# EAGLE design gps (EAGLE 5.12)
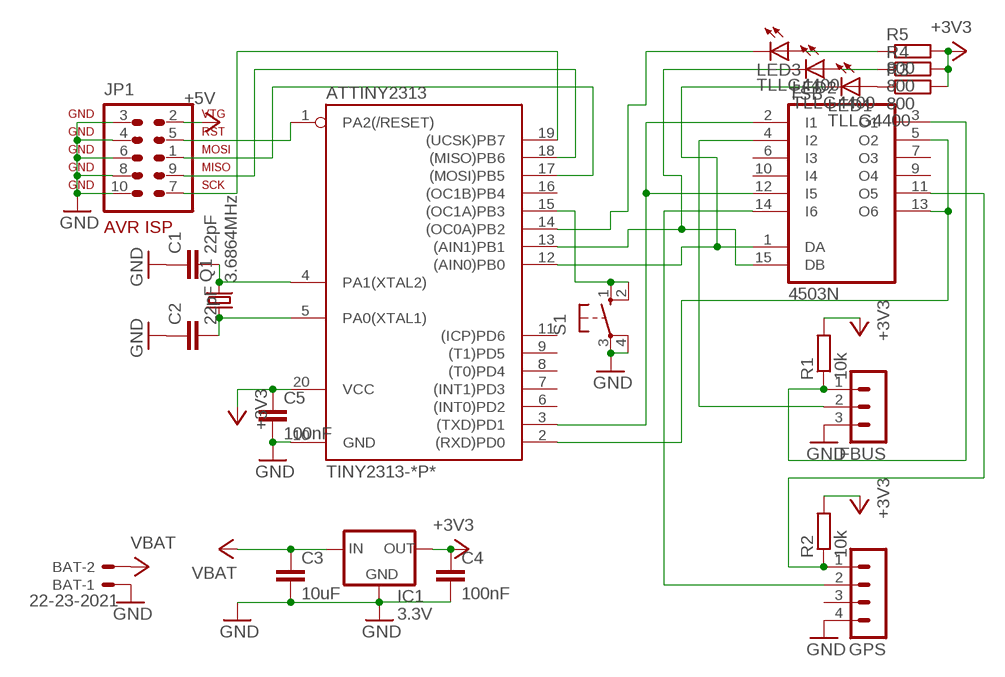
[diagram p0: schematic, sheet 1]

## Parts
ATTINY2313  TINY2313-*P*  [DIL20]
BAT  22-23-2021  [22-23-2021]
C1  22pF  C-EU025-024X044  [C025-024X044]
C2  22pF  C-EU025-024X044  [C025-024X044]
C3  10uF  C-EU025-025X050  [C025-025X050]
C4  100nF  C-EU025-025X050  [C025-025X050]
C5  100nF  C-EU025-025X050  [C025-025X050]
FBUS  MA03-1  [MA03-1]
GPS  MA04-1  [MA04-1]
IC1  3.3V  LM1117V  [78XXS]
JP1  AVR-ISP-10  [AVR-ISP-10]
LED1  TLLG4400  [LED3MM]
LED2  TLLG4400  [LED3MM]
LED3  TLLG4400  [LED3MM]
Q1  3.6864MHz  CRYSTALHC49U-V  [HC49U-V]
R1  10k  R-EU_0204/5  [0204/5]
R2  10k  R-EU_0204/5  [0204/5]
R3  800  R-EU_0204/7  [0204/7]
R4  800  R-EU_0204/7  [0204/7]
R5  800  R-EU_0204/7  [0204/7]
S1  10-XX  [B3F-10XX]
TSB  4503N  [DIL16]

## Nets
+3V3: ATTINY2313.20(VCC) C4.1 C5.1 IC1.OUT R1.2 R2.2 R3.2 R4.2 R5.2
+5V: JP1.2
GND: ATTINY2313.10(GND) BAT.1 C1.1 C2.1 C3.2 C4.2 C5.2 FBUS.3 GPS.4 IC1.GND JP1.3 JP1.4 JP1.6 JP1.8 JP1.10 S1.3(P) S1.4(P1)
N$1: ATTINY2313.4(PA1(XTAL2)) C1.2 Q1.2
N$2: ATTINY2313.5(PA0(XTAL1)) C2.2 Q1.1
N$3: FBUS.1 R1.1 TSB.3(O1)
N$5: FBUS.2 TSB.4(I2)
N$6: GPS.1 R2.1 TSB.11(O5)
N$7: ATTINY2313.3((TXD)PD1) TSB.2(I1) TSB.12(I5)
N$8: ATTINY2313.2((RXD)PD0) TSB.5(O2) TSB.13(O6)
N$9: GPS.2 TSB.14(I6)
N$10: ATTINY2313.12((AIN0)PB0) LED1.K(C) TSB.1(DA)
N$11: ATTINY2313.13((AIN1)PB1) LED2.K(C) TSB.15(DB)
N$12: ATTINY2313.1(PA2(/RESET)) JP1.5
N$13: ATTINY2313.17((MOSI)PB5) ATTINY2313.18((MISO)PB6) JP1.1 JP1.9
N$14: ATTINY2313.19((UCSK)PB7) JP1.7
N$15: ATTINY2313.14((OC0A)PB2) LED3.K(C)
N$16: LED1.A R3.1
N$17: LED2.A R4.1
N$18: LED3.A R5.1
N$19: ATTINY2313.15((OC1A)PB3) S1.1(S) S1.2(S1)
VCC: BAT.2 C3.1 IC1.IN ; supply symbol labelled VBAT
Unconnected: ATTINY2313.6((INT0)PD2) ATTINY2313.7((INT1)PD3) ATTINY2313.8((T0)PD4) ATTINY2313.9((T1)PD5) ATTINY2313.11((ICP)PD6) ATTINY2313.16((OC1B)PB4) GPS.3 TSB.6(I3) TSB.7(O3) TSB.9(O4) TSB.10(I4)

## Power pins joined to a net without a drawn wire
VDD: TSB.16(VDD)
VSS: TSB.8(VSS)

## Library data of the parts
ATTINY2313 = avr-7:TINY2313*: Atmel Tiny2313 2K Flash, 128 bytes EEPROM, 128 bytes RAM
BAT = con-molex:22-23-2021: .100" (2.54mm) Center Header - 2 Pin; MF: MOLEX; MPN: 22-23-2021; OC_FARNELL: 1462926; OC_NEWARK: 25C3832
C1-C5 = resistor:C-EU: CAPACITOR, European symbol
FBUS = con-lstb:MA03-1: PIN HEADER; OC_FARNELL: unknown; OC_NEWARK: unknown
GPS = con-lstb:MA04-1: PIN HEADER; OC_FARNELL: unknown; OC_NEWARK: unknown
IC1 = v-reg-2:LM1117
JP1 = avr-7:AVR-ISP-10: AVR ISP-10 Serial Programming Header
LED1-LED3 = led:TLLG4400: Low Current (2mA) LED 3 mm Tinted Diffused Package color GREEN Source: Data sheet <http://www.farnell.com/datasheets/391098.pdf>; MF: VISHAY SEMICONDUCTOR; OC_FARNELL: 1612435
Q1 = crystal:CRYSTAL: CRYSTAL; OC_FARNELL: 1666969; OC_NEWARK: unknown
R1-R5 = resistor:R-EU_: RESISTOR, European symbol
S1 = switch-omron:10-XX: OMRON SWITCH; MPN: B3F-1000; OC_FARNELL: 176432; OC_NEWARK: 36M3542
TSB = 45xx:4503: Tri-state hex BUFFER, 74C367, 80C97

## Board
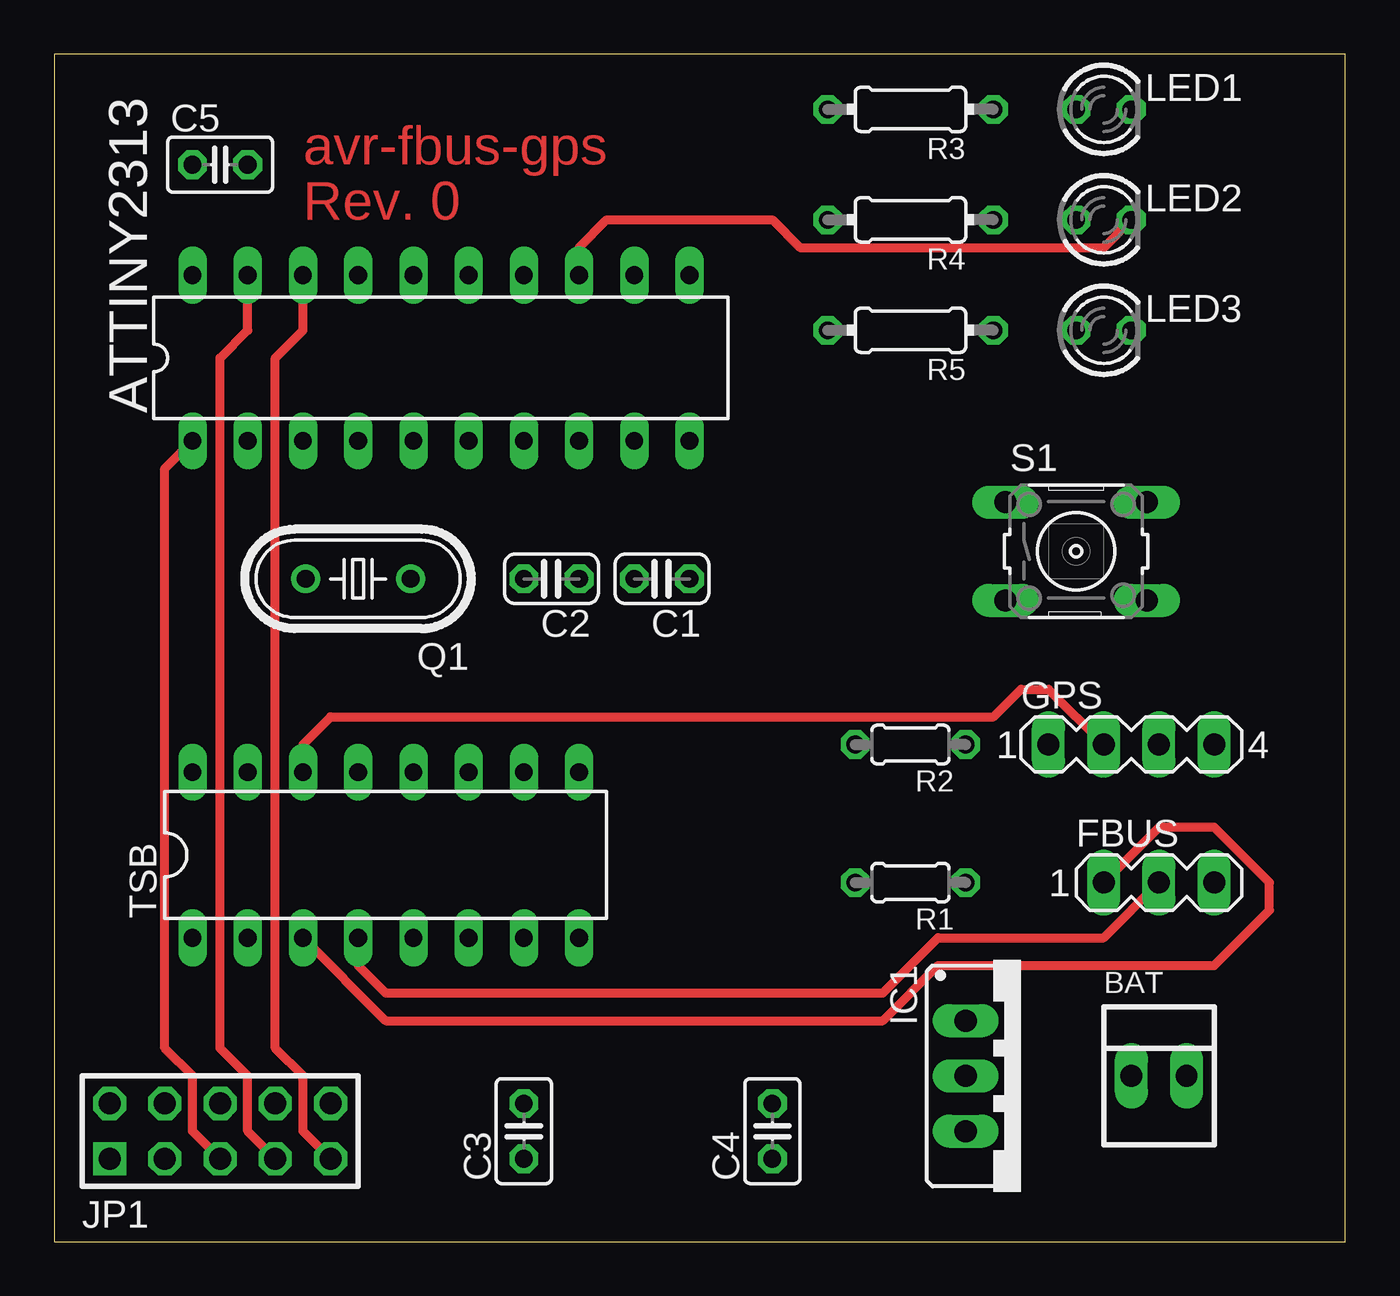
[diagram p1: board, top side]
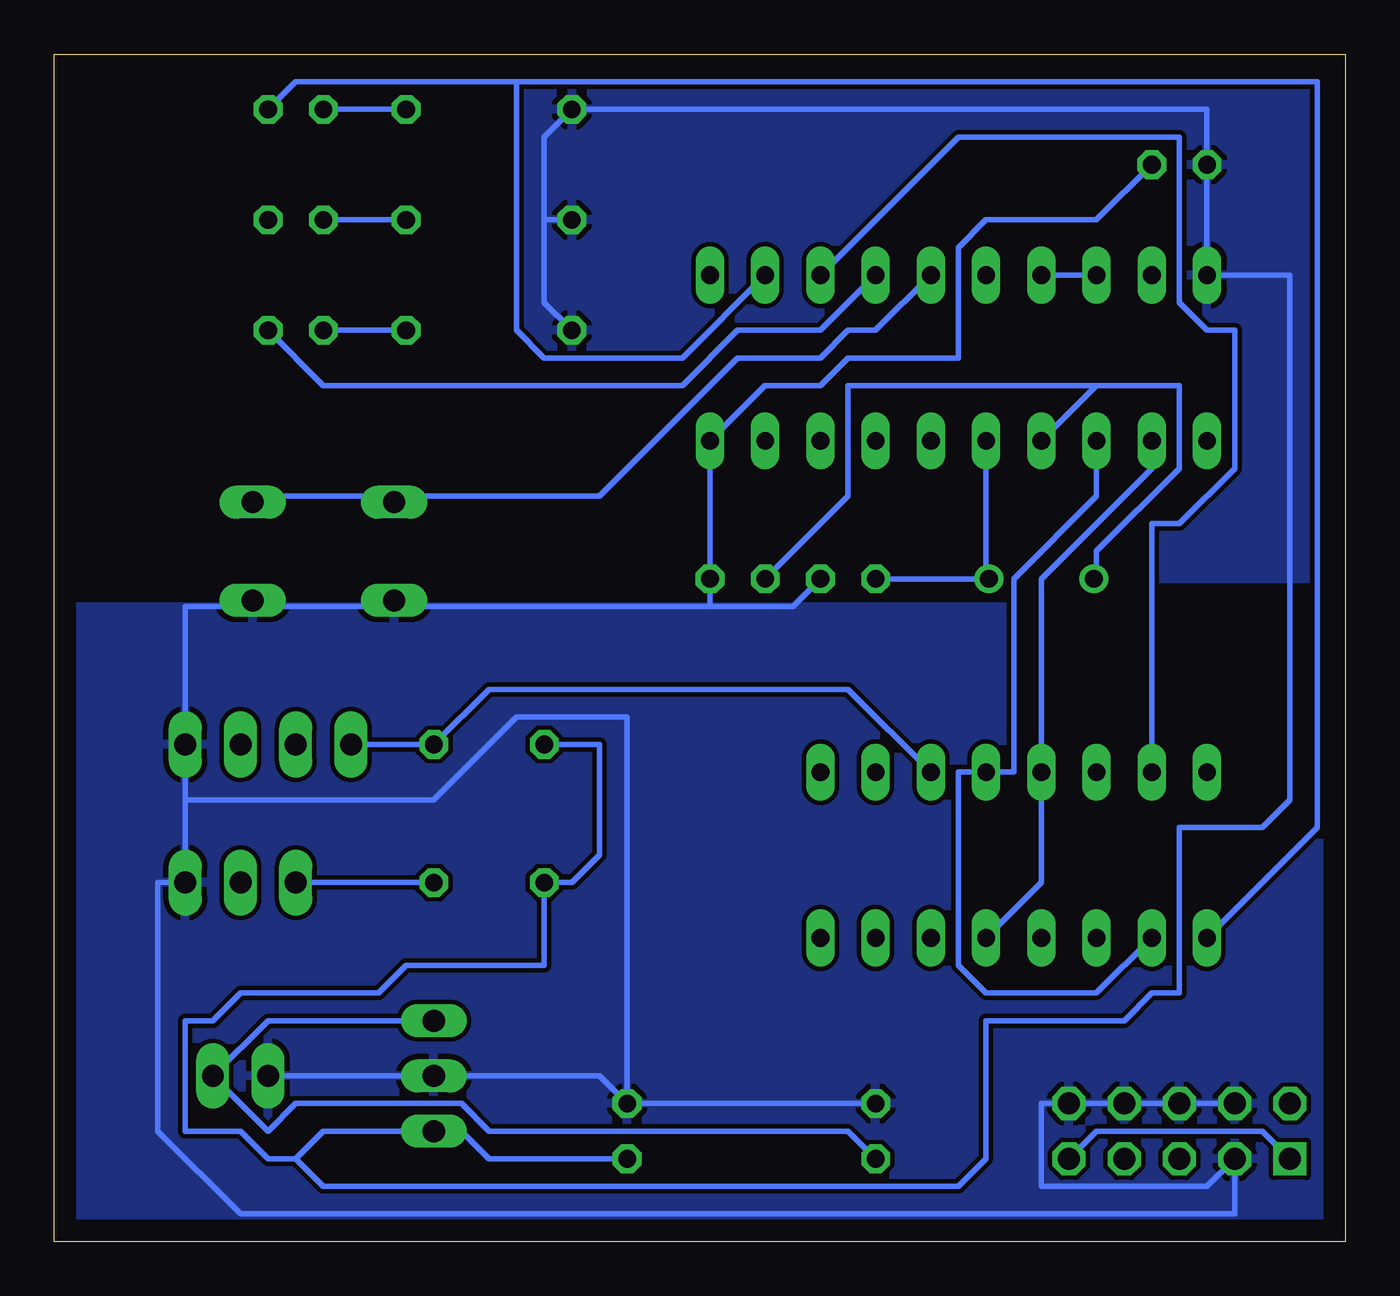
[diagram p2: board, bottom side, seen from below]

Size 59.36 x 54.6 mm. Coordinates in mm from the lower left corner, seen from the top.
Outline: 0,0 59.36,0 59.36,54.6 0,54.6 0,0
Copper layers (1*16): Top 0.035mm / dielectric 1.5mm / Bottom 0.035mm
Design rules "default": minimum track width 10mil, minimum drill 24mil, track to track 8mil, track to pad 8mil, pad to pad 8mil, via to via 8mil, smd to smd 8mil, copper to edge 40mil, drill to drill 8mil, minimum pad ring 10mil, minimum via ring 8mil, stop-mask expansion 4mil, vias tented up to drill 0mil, thermal gap 10mil

### Footprints (pad centres in the part's own frame; a part is rotated, then mirrored left to right if it is on the bottom)
DIL20 = drill 0.813 long: 1 -11.43,-3.81; 2 -8.89,-3.81; 3 -6.35,-3.81; 4 -3.81,-3.81; 5 -1.27,-3.81; 6 1.27,-3.81; 7 3.81,-3.81; 8 6.35,-3.81; 9 8.89,-3.81; 10 11.43,-3.81; 11 11.43,3.81; 12 8.89,3.81; 13 6.35,3.81; 14 3.81,3.81; 15 1.27,3.81; 16 -1.27,3.81; 17 -3.81,3.81; 18 -6.35,3.81; 19 -8.89,3.81; 20 -11.43,3.81
22-23-2021 = drill 1 long: 1 -1.27,0; 2 1.27,0
C025-024X044 = drill 0.813 octagon: 1 -1.27,0; 2 1.27,0
C025-025X050 = drill 0.813 octagon: 1 -1.27,0; 2 1.27,0
MA03-1 = drill 1.016 long: 1 -2.54,0; 2 0,0; 3 2.54,0
MA04-1 = drill 1.016 long: 1 -3.81,0; 2 -1.27,0; 3 1.27,0; 4 3.81,0
78XXS = drill 1.016 long: GND 0,-2.54; IN -2.54,-2.54; OUT 2.54,-2.54
AVR-ISP-10 = drill 1.016 square: 1 -5.08,-1.27 | drill 1.016 octagon: 2 -5.08,1.27; 3 -2.54,-1.27; 4 -2.54,1.27; 5 0,-1.27; 6 0,1.27; 7 2.54,-1.27; 8 2.54,1.27; 9 5.08,-1.27; 10 5.08,1.27
LED3MM = drill 0.813 octagon: A -1.27,0; K 1.27,0
HC49U-V = drill 0.813 round: 1 -2.413,0; 2 2.413,0
0204/5 = drill 0.813 octagon: 1 -2.54,0; 2 2.54,0
0204/7 = drill 0.813 octagon: 1 -3.81,0; 2 3.81,0
B3F-10XX = drill 1.016 long: 1 -3.251,2.261; 2 3.251,2.261; 3 -3.251,-2.261; 4 3.251,-2.261
DIL16 = drill 0.813 long: 1 -8.89,-3.81; 2 -6.35,-3.81; 3 -3.81,-3.81; 4 -1.27,-3.81; 5 1.27,-3.81; 6 3.81,-3.81; 7 6.35,-3.81; 8 8.89,-3.81; 9 8.89,3.81; 10 6.35,3.81; 11 3.81,3.81; 12 1.27,3.81; 13 -1.27,3.81; 14 -3.81,3.81; 15 -6.35,3.81; 16 -8.89,3.81

### Placement (x,y rotation side)
ATTINY2313  17.78,40.64 0 top
BAT  50.8,7.62 0 top
C1  27.94,30.48 180 top
C2  22.86,30.48 180 top
C3  21.59,5.08 90 top
C4  33.02,5.08 90 top
C5  7.62,49.53 0 top
FBUS  50.8,16.51 0 top
GPS  49.53,22.86 0 top
IC1  44.45,7.62 270 top
JP1  7.62,5.08 0 top
LED1  48.26,52.07 0 top
LED2  48.26,46.99 0 top
LED3  48.26,41.91 0 top
Q1  13.97,30.48 180 top
R1  39.37,16.51 180 top
R2  39.37,22.86 180 top
R3  39.37,52.07 180 top
R4  39.37,46.99 180 top
R5  39.37,41.91 180 top
S1  46.99,31.75 0 top
TSB  15.24,17.78 0 top

### Tracks (layer width: path | path; a pad name or v marks a point on that pad's centre or on a via)
+3V3
  Bottom 0.254: R2.2 34.29,22.86 34.29,17.78 35.56,16.51 R1.2 36.83,12.7 43.18,12.7 44.45,11.43 50.8,11.43 52.07,10.16 53.34,10.16 53.34,5.08 50.8,5.08 49.53,3.81 48.26,3.81 | C4.1 39.37,3.81 40.64,5.08 IC1.OUT 46.99,5.08 48.26,3.81 | R5.2 36.83,43.18 36.83,46.99 | 36.83,46.99 R4.2 | 36.83,46.99 36.83,50.8 R3.2 6.35,52.07 C5.1 ATTINY2313.20 2.54,44.45 2.54,20.32 3.81,19.05 7.62,19.05 7.62,11.43 8.89,11.43 10.16,10.16 16.51,10.16 16.51,3.81 17.78,2.54 46.99,2.54 48.26,3.81
  pour Bottom: -3.81,30.48 62.23,30.48 62.23,57.15 -3.81,57.15
  pour Bottom: 5.08,30.48 59.69,30.48 59.69,55.88 5.08,55.88
GND
  Bottom 0.254: BAT.1 IC1.GND 34.29,7.62 C4.2 | C4.2 C3.2 | JP1.4 JP1.6 JP1.8 JP1.10 13.97,6.35 13.97,2.54 6.35,2.54 JP1.3 5.08,1.27 50.8,1.27 54.61,5.08 54.61,16.51 FBUS.3 53.34,20.32 | 53.34,20.32 GPS.4 53.34,29.21 50.8,29.21 S1.4 49.53,29.21 44.45,29.21 S1.3 43.18,29.21 29.21,29.21 | C2.1 25.4,29.21 29.21,29.21 | 29.21,29.21 C1.1 ATTINY2313.10 26.67,39.37 24.13,39.37 22.86,40.64 17.78,40.64 17.78,45.72 16.51,46.99 11.43,46.99 C5.2 | C4.2 33.02,24.13 38.1,24.13 41.91,20.32 53.34,20.32
  pour Bottom: -3.81,-1.27 62.23,-1.27 62.23,29.21 -3.81,29.21
N$1
  Bottom 0.254: 11.43,39.37 7.62,39.37 7.62,35.56 11.43,31.75 11.43,30.48 Q1.2 | 11.43,39.37 ATTINY2313.4 | C1.2 22.86,34.29 22.86,39.37 11.43,39.37
N$2
  Bottom 0.254: 16.51,30.48 C2.2 | 16.51,30.48 ATTINY2313.5 | Q1.1 16.51,30.48
N$3
  Top 0.406: TSB.3 15.24,10.16 38.1,10.16 40.64,12.7 53.34,12.7 55.88,15.24 55.88,16.51 53.34,19.05 50.8,19.05 FBUS.1
  Bottom 0.254: FBUS.1 R1.1
N$5
  Top 0.406: TSB.4 13.97,12.7 15.24,11.43 38.1,11.43 40.64,13.97 48.26,13.97 FBUS.2
N$6
  Bottom 0.254: TSB.11 22.86,25.4 39.37,25.4 R2.1 GPS.1
N$7
  Bottom 0.254: TSB.2 11.43,11.43 16.51,11.43 17.78,12.7 17.78,21.59 TSB.12 15.24,21.59 15.24,30.48 11.43,34.29 ATTINY2313.3
N$8
  Bottom 0.254: TSB.5 13.97,16.51 TSB.13 13.97,30.48 8.89,35.56 ATTINY2313.2
N$9
  Top 0.406: TSB.14 11.43,22.86 12.7,24.13 43.18,24.13 44.45,25.4 45.72,25.4 GPS.2
N$10
  Bottom 0.254: TSB.1 1.27,19.05 1.27,53.34 38.1,53.34 | 38.1,53.34 48.26,53.34 LED1.K | ATTINY2313.12 30.48,40.64 36.83,40.64 38.1,41.91 38.1,53.34
N$11
  Top 0.406: ATTINY2313.13 24.13,45.72 25.4,46.99 33.02,46.99 34.29,45.72 48.26,45.72 LED2.K
  Bottom 0.254: TSB.15 8.89,33.02 7.62,33.02 5.08,35.56 5.08,41.91 6.35,41.91 7.62,43.18 7.62,50.8 17.78,50.8 ATTINY2313.13
N$12
  Top 0.406: ATTINY2313.1 5.08,35.56 5.08,8.89 6.35,7.62 6.35,5.08 JP1.5
N$13
  Top 0.406: ATTINY2313.18 11.43,41.91 10.16,40.64 10.16,8.89 11.43,7.62 11.43,5.08 JP1.9
  Bottom 0.254: JP1.1 3.81,5.08 11.43,5.08 JP1.9 | ATTINY2313.18 ATTINY2313.17
N$14
  Top 0.406: ATTINY2313.19 8.89,41.91 7.62,40.64 7.62,8.89 8.89,7.62 8.89,5.08 JP1.7
N$15
  Bottom 0.254: ATTINY2313.14 24.13,41.91 27.94,41.91 30.48,39.37 46.99,39.37 LED3.K
N$16
  Bottom 0.254: R3.1 LED1.A
N$17
  Bottom 0.254: R4.1 LED2.A
N$18
  Bottom 0.254: R5.1 LED3.A
N$19
  Bottom 0.254: ATTINY2313.15 21.59,41.91 22.86,41.91 24.13,40.64 27.94,40.64 34.29,34.29 43.18,34.29 S1.1 44.45,34.29 49.53,34.29 S1.2
VCC
  Bottom 0.254: C3.1 22.86,5.08 39.37,5.08 40.64,6.35 48.26,6.35 49.53,5.08 BAT.2 49.53,10.16 IC1.IN

### Text on the board
Top: avr-fbus-gps | Rev. 0